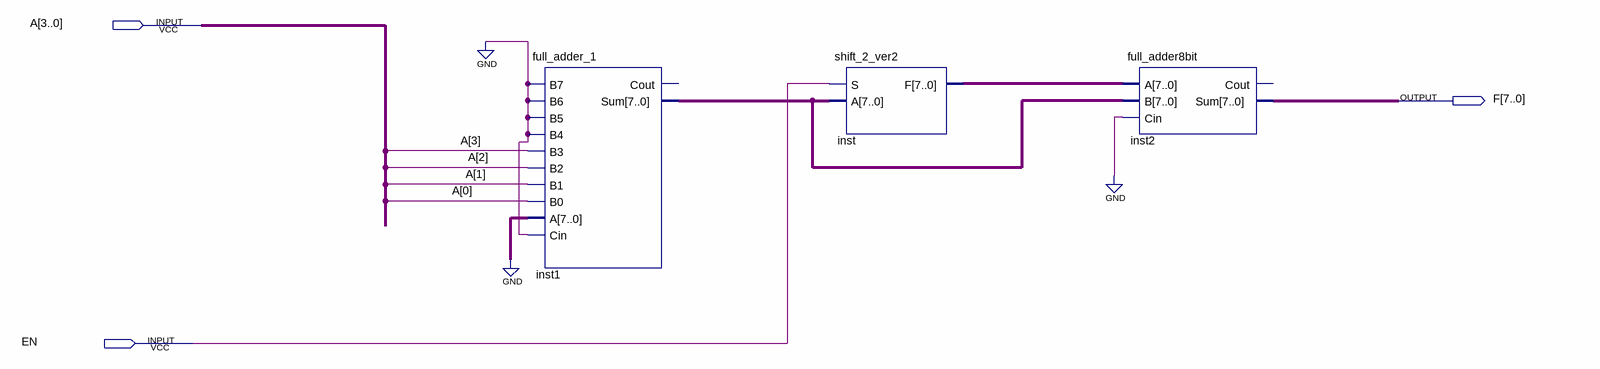
[diagram p0: schematic sheet]
// Quartus schematic Multiply_ver2.bdf as structural Verilog: 3 symbols, 3 pins
module Multiply_ver2 (
  input  [3:0] A,
  input  EN,
  output [7:0] F
);

  wire [7:0] inst1_sum, inst_f;

  full_adder_1 inst1 (
    .B7(1'b0), .B6(1'b0), .B5(1'b0), .B4(1'b0), .B3(A[3]), .B2(A[2]), .B1(A[1]), .B0(A[0]), .A({8{1'b0}}),
    .Cin(1'b0), .Sum(inst1_sum));  // open: Cout
  shift_2_ver2 inst (.S(EN), .A(inst1_sum), .F(inst_f));
  full_adder8bit inst2 (.A(inst_f), .B(inst1_sum), .Cin(1'b0), .Sum(F));  // open: Cout
endmodule
